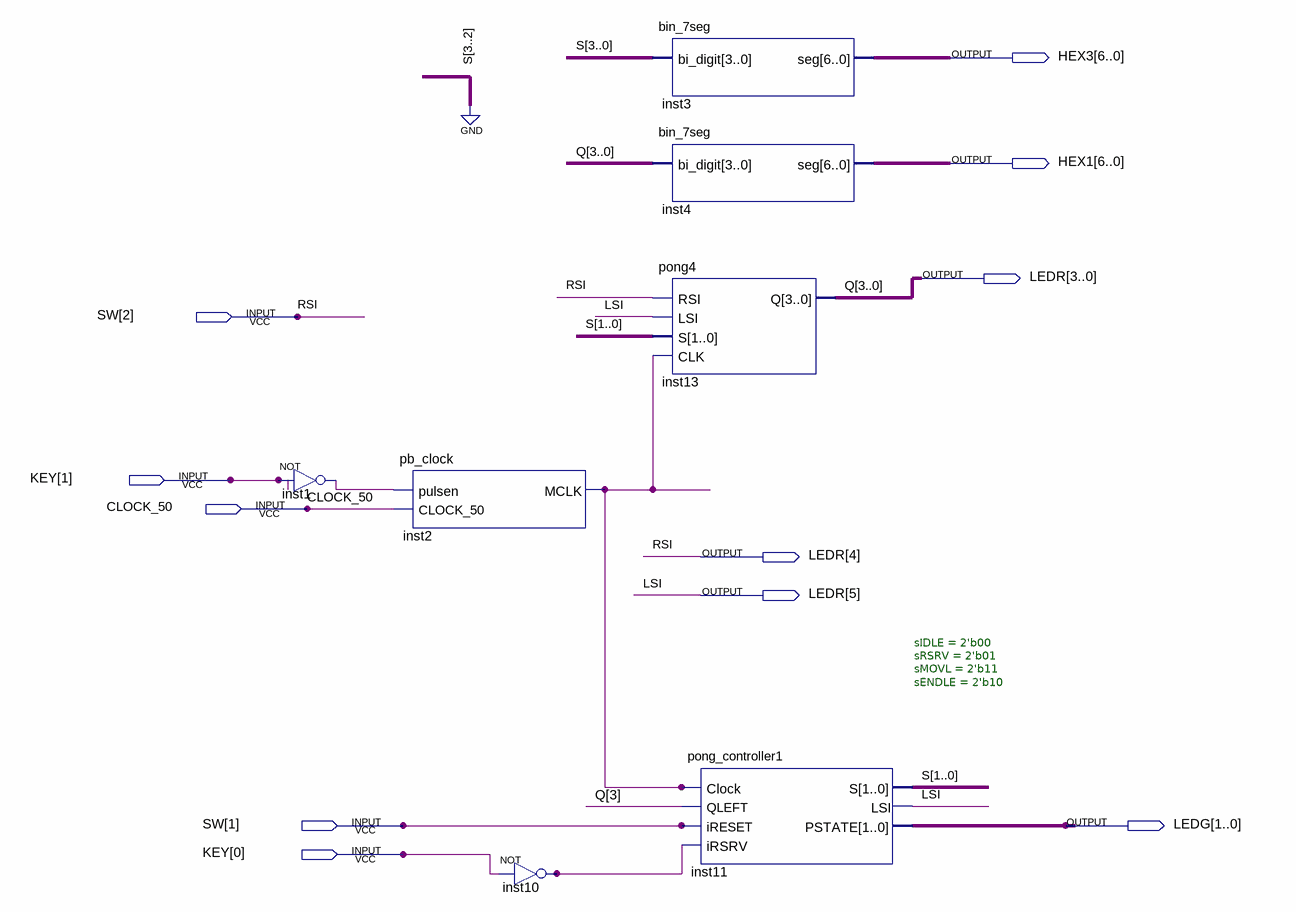
[diagram p0: schematic sheet]
// Quartus schematic Lab8.bdf as structural Verilog: 7 symbols, 11 pins
module Lab8 (
  input  [2:1] SW,
  input  [1:0] KEY,
  input  CLOCK_50,
  output [6:0] HEX3,
  output [6:0] HEX1,
  output [5:0] LEDR,
  output [1:0] LEDG
);

  wire inst1_out, inst2_mclk, inst10_out;
  wire [1:0] S;

  not inst1 (inst1_out, KEY[1]);
  pb_clock inst2 (.pulsen(inst1_out), .CLOCK_50(CLOCK_50), .MCLK(inst2_mclk));
  not inst10 (inst10_out, KEY[0]);
  bin_7seg inst3 (.bi_digit({2'b00, S}), .seg(HEX3));
  bin_7seg inst4 (.bi_digit(LEDR[3:0]), .seg(HEX1));
  pong4 inst13 (.RSI(SW[2]), .LSI(LEDR[5]), .S(S), .CLK(inst2_mclk), .Q(LEDR[3:0]));
  pong_controller1 #(.sIDLE(2'b00), .sRSRV(2'b01), .sMOVL(2'b11), .sENDLE(2'b10)) inst11 (
    .Clock(inst2_mclk), .QLEFT(LEDR[3]), .iRESET(SW[1]), .iRSRV(inst10_out), .S(S), .LSI(LEDR[5]),
    .PSTATE(LEDG));

  assign LEDR[4] = SW[2];

  // Other names for the same wires on the sheet: Q[3:0] = LEDR[3:0]; LSI = LEDR[5]; RSI = SW[2]
endmodule
